# Altium schematic sheet Processing_Unit.SchDoc
size A4; SheetNumber: 3; SheetTotal: 4
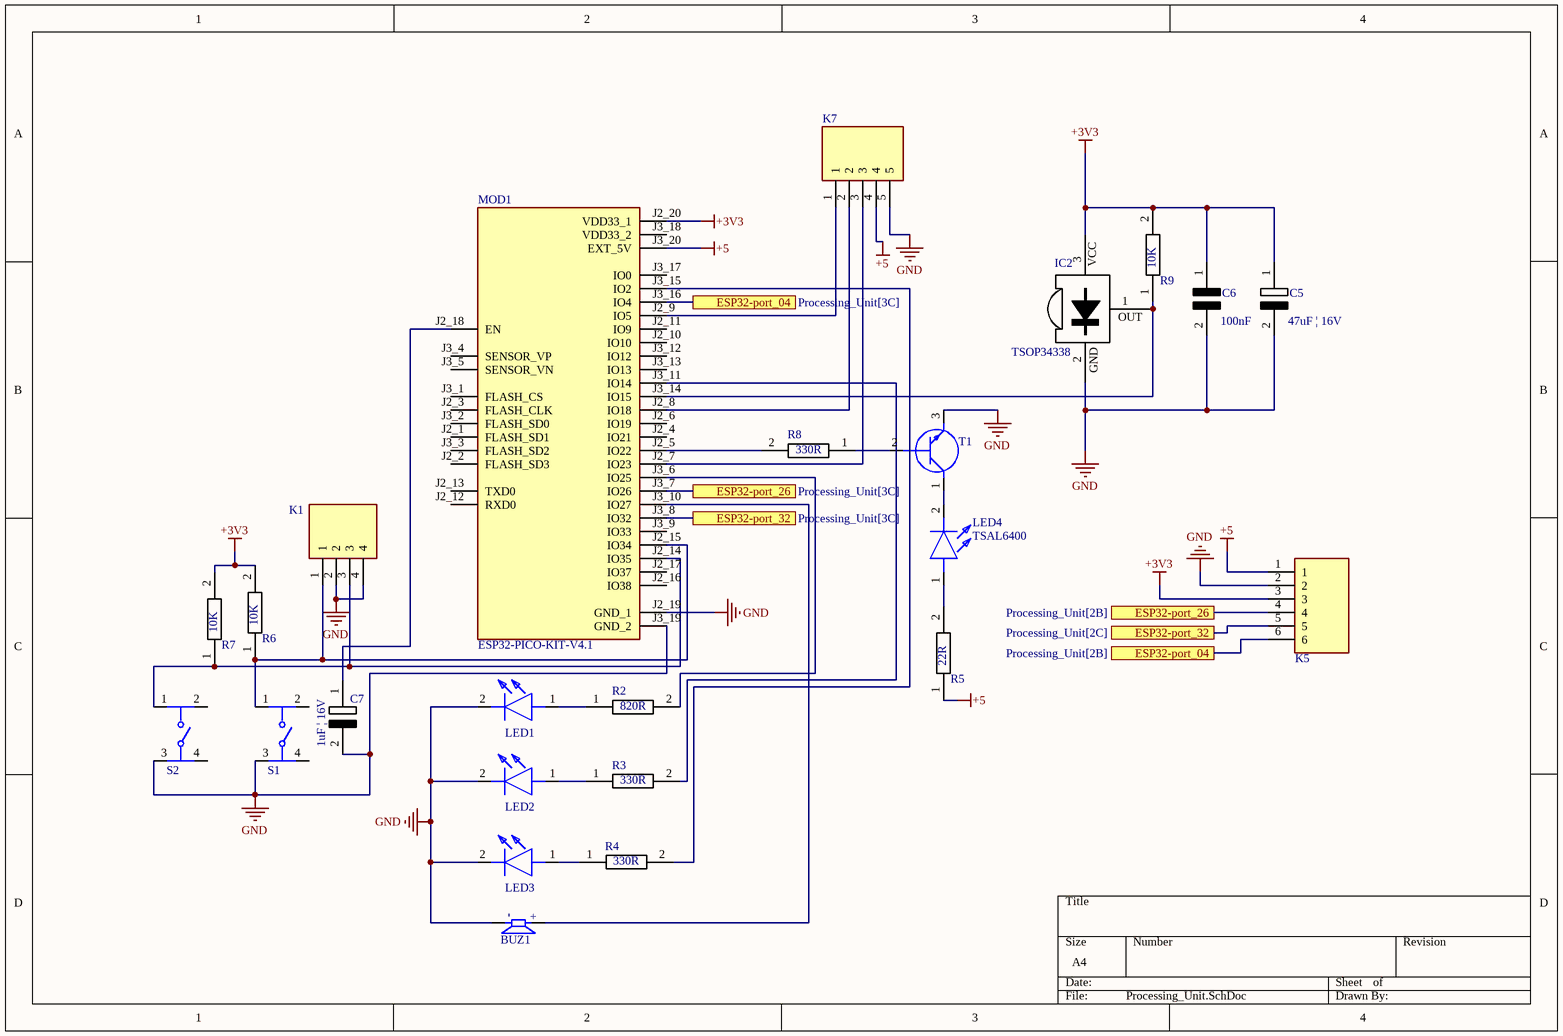
[diagram p0: Processing_Unit.SchDoc]

## Parts
BUZ1  CEM-1212S  [CUI_CEM-1212S]  (value not drawn)
C5  47uF | 16V  [C0805]
C6  100nF  [C0805]
C7  1uF | 16V  [C0805]
IC2  TSOP34338  [TO_TSOP31236]
K1  2212S-04SG-85  [2212S04SG85]  (value not drawn)
K5  2212S-06SG-85  [RHDR6W74P0X254_1X6_1574X250X850P]  (value not drawn)
K7  2212S-05SG-85  [RHDR5W74P0X254_1X5_1320X250X850P]  (value not drawn)
LED1  TLHO4200  [TLHO4200]  (value not drawn)
LED2  TLHO4200  [TLHO4200]  (value not drawn)
LED3  TLHO4200  [TLHO4200]  (value not drawn)
LED4  TSAL6400  [TSAL6400]
MOD1  ESP32-PICO-KIT-V4.1  [XCVR_ESP32-PICO-KIT-V4.1]
R2  820R  [C0805]
R3  330R  [C0805]
R4  330R  [C0805]
R5  22R  [C0805]
R6  10K  [C0805]
R7  10K  [C0805]
R8  330R  [C0805]
R9  10K  [C0805]
S1  FSM103  [FP-FSM103-MFG]  (value not drawn)
S2  FSM103  [FP-FSM103-MFG]  (value not drawn)
T1  BC33716TA  [BC33716TA]  (value not drawn)

## Ports
ESP32-port_04 (see Processing_Unit[2B]), ESP32-port_04 (see Processing_Unit[3C]), ESP32-port_26 (see Processing_Unit[2B]), ESP32-port_26 (see Processing_Unit[3C]), ESP32-port_32 (see Processing_Unit[2C]), ESP32-port_32 (see Processing_Unit[3C])

## Nets
+3V3: C5.1 C6.1 IC2.3(VS) K5.3 MOD1.J2_20(VDD33_1) R6.2 R7.2 R9.2
+5: K5.1 K7.4 MOD1.J3_20(EXT_5V) R5.1
GND: BUZ1.M C5.2 C6.2 C7.2 IC2.2(GND) K1.2 K1.4 K5.2 K7.5 LED1.2(K) LED2.2(K) LED3.2(K) MOD1.J2_19(GND_1) MOD1.J3_19(GND_2) S1.3 S2.3 T1.3(E)
ESP32-port_04: K5.6 MOD1.J3_16(IO4) ; port ESP32-port_04
ESP32-port_26: K5.4 MOD1.J3_7(IO26) ; port ESP32-port_26
ESP32-port_32: K5.5 MOD1.J3_8(IO32) ; port ESP32-port_32
NetBUZ1_P: BUZ1.P MOD1.J3_10(IO27)
NetC7_1: C7.1 MOD1.J2_18(EN)
NetIC2_1: IC2.1(OUT) MOD1.J3_14(IO15) R9.1
NetK1_1: K1.1 MOD1.J2_15(IO34) R6.1 S1.1
NetK1_3: K1.3 MOD1.J2_14(IO35) R7.1 S2.1
NetK7_1: K7.1 MOD1.J2_9(IO5)
NetK7_2: K7.2 MOD1.J2_8(IO18)
NetK7_3: K7.3 MOD1.J2_7(IO23)
NetLED1_1: LED1.1(A) R2.1
NetLED2_1: LED2.1(A) R3.1
NetLED3_1: LED3.1(A) R4.1
NetLED4_1: LED4.1(A) R5.2
NetLED4_2: LED4.2(K) T1.1(C)
NetMOD1_J2_5: MOD1.J2_5(IO22) R8.2
NetMOD1_J3_6: MOD1.J3_6(IO25) R2.2
NetMOD1_J3_11: MOD1.J3_11(IO14) R3.2
NetMOD1_J3_15: MOD1.J3_15(IO2) R4.2
NetR8_1: R8.1 T1.2(B)

Not connected (* = marked no-connect by the designer): MOD1 J2_1(FLASH_SD1) J2_2(FLASH_SD3) J2_3(FLASH_CLK) J2_4(IO21) J2_6(IO19) J2_10(IO10) J2_11(IO9) J2_12(RXD0) J2_13(TXD0) J2_16(IO38) J2_17(IO37) J3_1(FLASH_CS) J3_2(FLASH_SD0) J3_3(FLASH_SD2) J3_4(SENSOR_VP) J3_5(SENSOR_VN) J3_9(IO33) J3_12(IO12) J3_13(IO13) J3_17(IO0) J3_18(VDD33_2); S1 2 4; S2 2 4

## Notes on the sheet
- (in symbol CEM-1212S) -; +
- (in symbol TSOP34338) VCC

## Library data of the parts
BUZ1 = CEM-1212S: 12 mm, 12 V, 85 dB, Through Hole, Sealed, Magnetic Audio Transducer Buzzer; MF: CUI Devices; Arrow_Electronics-Purchase-URL: https://snapeda.com/shop?store=Arrow+Electronics&id=601563; Value: *; SnapEDA_Link: https://www.snapeda.com/parts/CEM-1212S/CUI%20Devices/view-part/601563/?ref=snap; CUI_purchase_URL: https://www.cuidevices.com/product/audio/buzzers/audio-transducers/cem-1212s?utm_source=snapeda.com&utm_medium=referral&utm_campaign=snapedaBOM; MP: CEM-1212S; Availability: Good; Mouser-Purchase-URL: https://snapeda.com/shop?store=Mouser&id=601563; Price: None; DigiKey-Purchase-URL: https://snapeda.com/shop?store=DigiKey&id=601563; Package: TO-220 CUI Inc.
C5 C7 = elektrolytischeC0805: 0805 ceramic capacitor; Manufacturer_Name: Murata Electronics; Manufacturer_Part_Number: GRM188R71H103KA01D; Datasheet Link: https://datasheet.datasheetarchive.com/originals/distributors/Datasheets_SAMA/ec4f1577dddcc7a13ddad897a28002d3.pdf; Height: 0.9mm; Mouser Part Number: 81-GRM39X103K50D; Mouser Price/Stock: https://www.mouser.co.uk/ProductDetail/Murata-Electronics/GRM188R71H103KA01D?qs=WWniysbtxULrL2ljbViAbw%3D%3D; Arrow Part Number: GRM188R71H103KA01D; Arrow Price/Stock: https://www.arrow.com/en/products/grm188r71h103ka01d/murata-manufacturing?region=europe
C6 = KeramischeC0805_1: 0805 ceramic capacitor; Manufacturer_Name: Murata Electronics; Manufacturer_Part_Number: GRM188R71H103KA01D; Datasheet Link: https://datasheet.datasheetarchive.com/originals/distributors/Datasheets_SAMA/ec4f1577dddcc7a13ddad897a28002d3.pdf; Height: 0.9mm; Mouser Part Number: 81-GRM39X103K50D; Mouser Price/Stock: https://www.mouser.co.uk/ProductDetail/Murata-Electronics/GRM188R71H103KA01D?qs=WWniysbtxULrL2ljbViAbw%3D%3D; Arrow Part Number: GRM188R71H103KA01D; Arrow Price/Stock: https://www.arrow.com/en/products/grm188r71h103ka01d/murata-manufacturing?region=europe
IC2 = TSOP34338: No Description Available; Mfr_Name: Vishay; Type: Type; RefDes: RefDes
K1 = 2212S-04SG-85: Connector; Manufacturer_Name: Multicomp Pro; Datasheet Link: https://componentsearchengine.com/Datasheets/5/2212S-04SG-85.pdf; Height: 8.7mm; Manufacturer_Part_Number: 2212S-04SG-85
K5 = 2212S-06SG-85: Connector; Manufacturer_Name: Multicomp Pro; Datasheet Link: http://www.farnell.com/datasheets/2290158.pdf?_ga=2.3406896.1671530057.1506933545-2008293027.1497013038; Height: 8.5mm; Manufacturer_Part_Number: 2212S-06SG-85
K7 = 2212S-05SG-85: Connector; Manufacturer_Name: Multicomp Pro; Datasheet Link: https://componentsearchengine.com/Datasheets/2/2212S-05SG-85.pdf; Height: 8.5mm; Manufacturer_Part_Number: 2212S-05SG-85
LED1-LED3 = TLHO4200: LED; Manufacturer_Name: Vishay; Datasheet Link: https://www.mouser.com/datasheet/2/427/tlhg420-1767350.pdf; Height: 6.1mm; Manufacturer_Part_Number: TLHO4200
LED4 = TSAL6400: LED; Manufacturer_Name: Vishay; Datasheet Link: https://componentsearchengine.com/Datasheets/1/TSAL6400.pdf; Height: 9.7mm; Manufacturer_Part_Number: TSAL6400; Mouser Part Number: 782-TSAL6400; Mouser Price/Stock: https://www.mouser.co.uk/ProductDetail/Vishay-Semiconductors/TSAL6400?qs=oSAwVt7aKTHCOCv1ythi7g%3D%3D; Arrow Part Number: TSAL6400; Arrow Price/Stock: https://www.arrow.com/en/products/tsal6400/vishay?region=nac
MOD1 = ESP32-PICO-KIT-V4.1: WiFi Development Tools (802.11); MF: Espressif Systems; Price: None; Value: *; MP: ESP32-PICO-KIT-V4.1; Package: None; SnapEDA_Link: https://www.snapeda.com/parts/ESP32-PICO-KIT-V4.1/Espressif%20Systems/view-part/3211113/?ref=snap; Check_prices: https://www.snapeda.com/parts/ESP32-PICO-KIT-V4.1/Espressif%20Systems/view-part/3211113/?ref=eda; Availability: Bad
R2-R9 = Resistor0805: Manufacturer_Name: Vishay; Manufacturer_Part_Number: CRCW08050000Z0EAHP; Datasheet Link: https://componentsearchengine.com/Datasheets/1/CRCW08051R00FKEAHP.pdf; Height: 0.6mm; Mouser Part Number: 71-CRCW08050000Z0EAH; Mouser Price/Stock: https://www.mouser.co.uk/ProductDetail/Vishay-Dale/CRCW08050000Z0EAHP?qs=pTGEtN%252BMLlDLrJUqQmN2jA%3D%3D; Arrow Part Number: CRCW08050000Z0EAHP; Arrow Price/Stock: https://www.arrow.com/en/products/crcw08050000z0eahp/vishay?region=nac
S1 S2 = CMP-03407-000037-1: SWITCH TACTILE SPST-NO 0.05A 24V; Contact Resistance: 100mR; Actuator Length: 3.4mm; Switch Function: Off-Mom; Operating Force: 1.57N; Illumination Type: Non-Illuminated; Voltage Rating (DC): 12V; Current Rating: 50mA; Actuator Material: Polyester; Switch Travel: 0.3mm; Throw Configuration: SPST; Actuator Color: Black; Mechanical Life: 100000Cycles; Depth: 14.1mm; RoHS Compliant: Yes; Max Operating Temperature: 85°C; Mount: Through Hole; Min Operating Temperature: -35°C; Contact Plating: Silver; Width: 12mm; Package Quantity: 400; Radiation Hardening: No; Series: FSM100 ~ 104; Type: Switch; Termination: PC Pins; Voltage Rating: 24V; Contact Material: Brass; Max Voltage Rating (DC): 12V; Contact Current Rating: 50mA; Length: 12mm; Packaging: Loose Piece; Orientation: Straight; Max Current Rating: 50mA; Electrical Life: 100000Cycles
T1 = BC33716TA: Transistor BJT NPN; Manufacturer_Name: onsemi; Datasheet Link: https://rocelec.widen.net/view/pdf/hcqqbqwrik/ONSM-S-A0003590550-1.pdf?t.download=true&u=5oefqw; Height: 8.77mm; Manufacturer_Part_Number: BC33716TA; Mouser Part Number: 512-BC33716TA; Mouser Price/Stock: https://www.mouser.co.uk/ProductDetail/onsemi-Fairchild/BC33716TA?qs=UMEuL5FsraA5fR076NzQDQ%3D%3D; Arrow Part Number: BC33716TA; Arrow Price/Stock: https://www.arrow.com/en/products/bc33716ta/on-semiconductor?region=nac